# EAGLE design pitchosc (EAGLE 5.04)
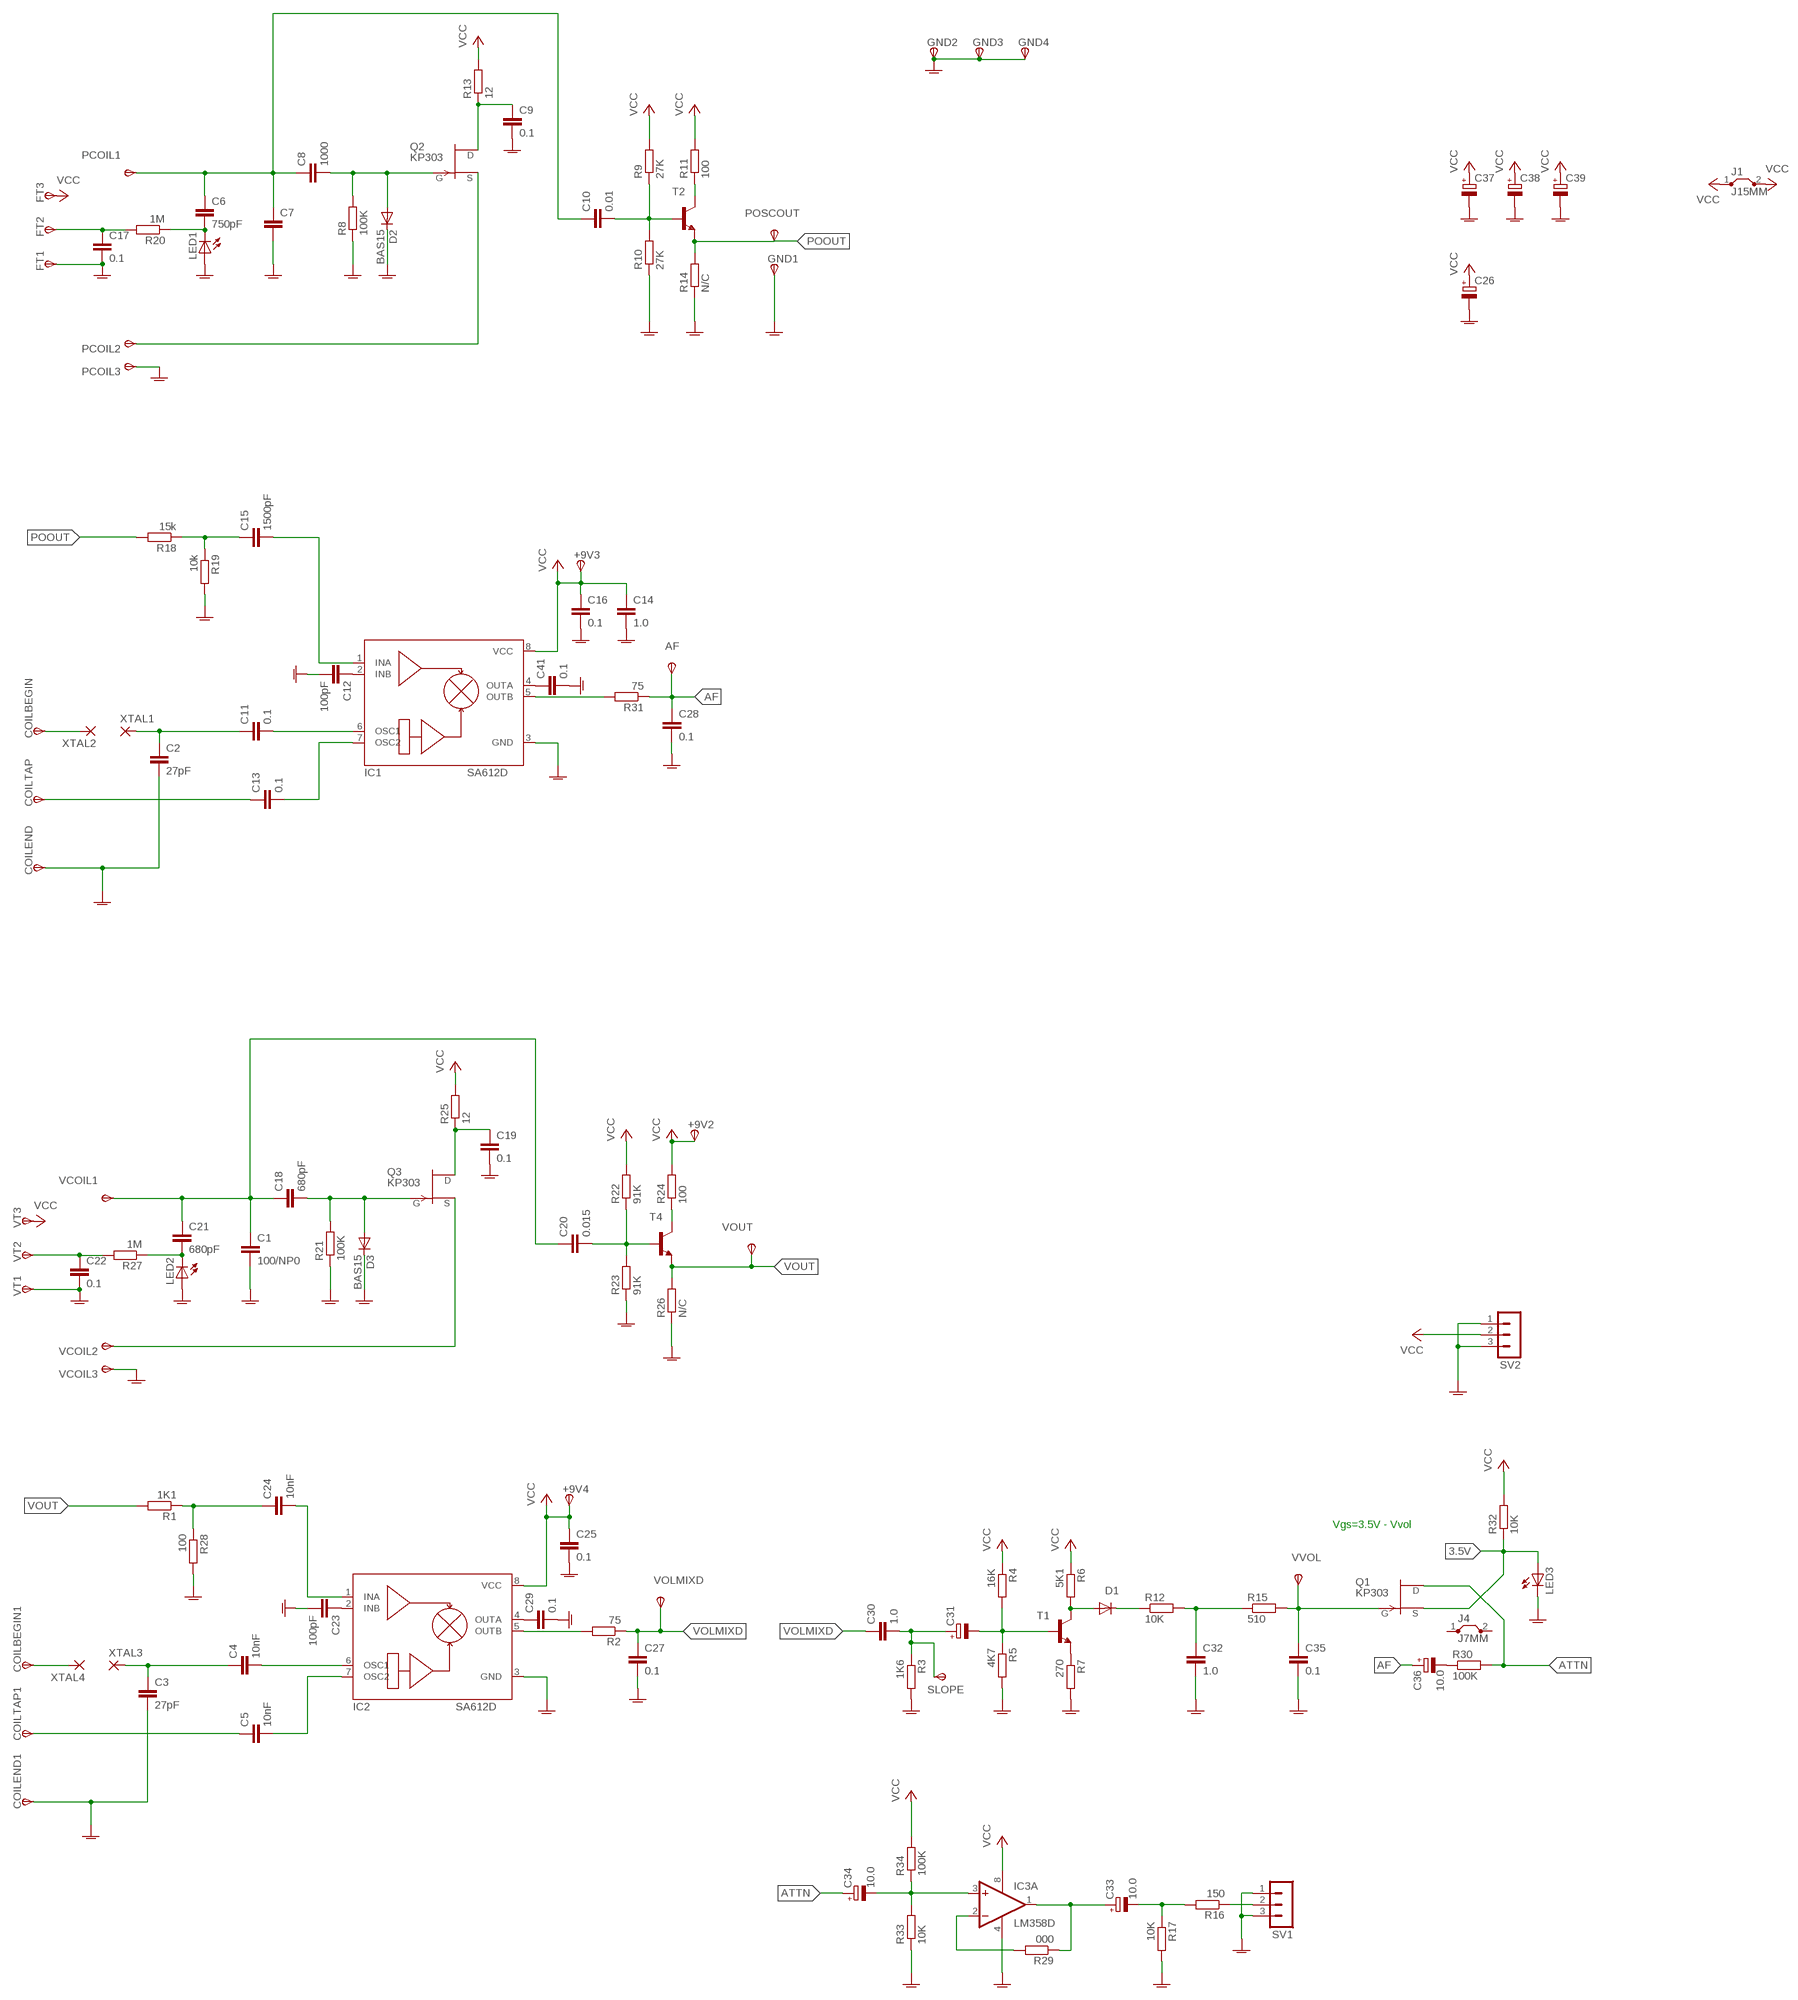
[diagram p0: schematic, sheet 1]

## Parts
+9V2  TPSPAD1-20  [P1-20]
+9V3  TPSPAD1-20  [P1-20]
+9V4  TPSPAD1-20  [P1-20]
AF  TPSPAD1-13Y  [P1-13Y]
C1  100/NP0  C-EUC0805K  [C0805K]
C2  27pF  C-EUC0805K  [C0805K]
C3  27pF  C-EUC0805K  [C0805K]
C4  10nF  C-EUC0805K  [C0805K]
C5  10nF  C-EUC0805K  [C0805K]
C6  750pF  C-EUC0805K  [C0805K]
C7  C-EUC0805K  [C0805K]
C8  1000  C-EUC0805K  [C0805K]
C9  0.1  C-EUC0805K  [C0805K]
C10  0.01  C-EUC0805K  [C0805K]
C11  0.1  C-EUC0805K  [C0805K]
C12  100pF  C-EUC0805K  [C0805K]
C13  0.1  C-EUC0805K  [C0805K]
C14  1.0  C-EUC0805K  [C0805K]
C15  1500pF  C-EUC0805K  [C0805K]
C16  0.1  C-EUC0805K  [C0805K]
C17  0.1  C-EUC0805K  [C0805K]
C18  680pF  C-EUC0805K  [C0805K]
C19  0.1  C-EUC0805K  [C0805K]
C20  0.015  C-EUC0805K  [C0805K]
C21  680pF  C-EUC0805K  [C0805K]
C22  0.1  C-EUC0805K  [C0805K]
C23  100pF  C-EUC0805K  [C0805K]
C24  10nF  C-EUC0805K  [C0805K]
C25  0.1  C-EUC0805K  [C0805K]
C26  CPOL-EUC/6032-28R  [C/6032-28R]
C27  0.1  C-EUC0805K  [C0805K]
C28  0.1  C-EUC0805K  [C0805K]
C29  0.1  C-EUC0805K  [C0805K]
C30  1.0  C-EUC0805K  [C0805K]
C31  CPOL-EUB/3528-21R  [B/3528-21R]
C32  1.0  C-EUC0805K  [C0805K]
C33  10.0  CPOL-EUB/3528-21R  [B/3528-21R]
C34  10.0  CPOL-EUB/3528-21R  [B/3528-21R]
C35  0.1  C-EUC0805K  [C0805K]
C36  10.0  CPOL-EUB/3528-21R  [B/3528-21R]
C37  CPOL-EUB/3528-21R  [B/3528-21R]
C38  CPOL-EUB/3528-21R  [B/3528-21R]
C39  CPOL-EUB/3528-21R  [B/3528-21R]
C41  0.1  C-EUC0805K  [C0805K]
COILBEGIN  TPSPAD1-20Y  [P1-20Y]
COILBEGIN1  TPSPAD1-20Y  [P1-20Y]
COILEND  TPSPAD1-20Y  [P1-20Y]
COILEND1  TPSPAD1-20Y  [P1-20Y]
COILTAP  TPSPAD1-20Y  [P1-20Y]
COILTAP1  TPSPAD1-20Y  [P1-20Y]
D1  BAS15  [DO34-7]
D2  BAS15  [DO34-7]
D3  BAS15  [DO34-7]
FT1  TPSPAD1-13Y  [P1-13Y]
FT2  TPSPAD1-13Y  [P1-13Y]
FT3  TPSPAD1-13Y  [P1-13Y]
GND1  TPSPAD1-20Y  [P1-20Y]
GND2  TPSPAD1-20Y  [P1-20Y]
GND3  TPSPAD1-20Y  [P1-20Y]
GND4  TPSPAD1-20Y  [P1-20Y]
IC1  SA612D  [SO08]
IC2  SA612D  [SO08]
IC3  LM358D  [SO08]
J1  J15MM  [15]
J4  J7MM  [07]
LED1  LED5MM  [LED5MM]
LED2  LED5MM  [LED5MM]
LED3  LED5MM  [LED5MM]
PCOIL1  TPSPAD1-20Y  [P1-20Y]
PCOIL2  TPSPAD1-20Y  [P1-20Y]
PCOIL3  TPSPAD1-20Y  [P1-20Y]
POSCOUT  TPSPAD1-13Y  [P1-13Y]
Q1  KP303  [TO72]
Q2  KP303  [TO72]
Q3  KP303  [TO72]
R1  1K1  R-EU_R0805  [R0805]
R2  75  R-EU_R0805  [R0805]
R3  1K6  R-EU_R0805  [R0805]
R4  16K  R-EU_R0805  [R0805]
R5  4K7  R-EU_R0805  [R0805]
R6  5K1  R-EU_R0805  [R0805]
R7  270  R-EU_R0805  [R0805]
R8  100K  R-EU_R0805  [R0805]
R9  27K  R-EU_R0805  [R0805]
R10  27K  R-EU_R0805  [R0805]
R11  100  R-EU_R0805  [R0805]
R12  10K  R-EU_R0805  [R0805]
R13  12  R-EU_R0805  [R0805]
R14  N/C  R-EU_R0805  [R0805]
R15  510  R-EU_R0805  [R0805]
R16  150  R-EU_R0805  [R0805]
R17  10K  R-EU_R0805  [R0805]
R18  15k  R-EU_R0805  [R0805]
R19  10k  R-EU_R0805  [R0805]
R20  1M  R-EU_R0805  [R0805]
R21  100K  R-EU_R0805  [R0805]
R22  91K  R-EU_R0805  [R0805]
R23  91K  R-EU_R0805  [R0805]
R24  100  R-EU_R0805  [R0805]
R25  12  R-EU_R0805  [R0805]
R26  N/C  R-EU_R0805  [R0805]
R27  1M  R-EU_R0805  [R0805]
R28  100  R-EU_R0805  [R0805]
R29  000  R-EU_R0805  [R0805]
R30  100K  R-EU_R0805  [R0805]
R31  75  R-EU_R0805  [R0805]
R32  10K  R-EU_R0805  [R0805]
R33  10K  R-EU_R0805  [R0805]
R34  100K  R-EU_R0805  [R0805]
SLOPE  TPSPAD1-13Y  [P1-13Y]
SV1  MA03-1  [MA03-1]
SV2  MA03-1  [MA03-1]
T1  BC817-16-NPN-SOT23-BEC  [SOT23-BEC]
T2  BC817-16-NPN-SOT23-BEC  [SOT23-BEC]
T4  BC817-16-NPN-SOT23-BEC  [SOT23-BEC]
VCOIL1  TPSPAD1-20Y  [P1-20Y]
VCOIL2  TPSPAD1-20Y  [P1-20Y]
VCOIL3  TPSPAD1-20Y  [P1-20Y]
VOLMIXD  TPSB2,54  [B2,54]
VOUT  TPSPAD1-13Y  [P1-13Y]
VT1  TPSPAD1-20Y  [P1-20Y]
VT2  TPSPAD1-20Y  [P1-20Y]
VT3  TPSPAD1-20Y  [P1-20Y]
VVOL  TPSB2,54  [B2,54]
XTAL1  2,54/1,1  [2,54/1,1]
XTAL2  2,54/1,1  [2,54/1,1]
XTAL3  2,54/1,1  [2,54/1,1]
XTAL4  2,54/1,1  [2,54/1,1]

## Nets
3.5V: LED3.A Q1.1(S) R32.1
AAA: C34.- IC3.3(A:+IN) R33.2 R34.1
AF: AF.1(PP) C28.1 C36.+ R31.1
AGND: C1.2 C2.2 C3.2 C7.2 C9.2 C12.2 C14.2 C16.2 C17.2 C19.2 C22.2 C23.2 C25.2 C26.- C27.2 C28.2 C29.2 C32.2 C35.2 C37.- C38.- C39.- C41.2 COILEND1.1(PP) COILEND.1(PP) D2.C D3.C FT1.1(PP) GND1.1(PP) GND2.1(PP) GND3.1(PP) GND4.1(PP) IC1.3(GND) IC2.3(GND) IC3.4(P:V-) LED1.A LED2.A LED3.K(C) PCOIL3.1(PP) R3.2 R5.2 R7.2 R8.1 R10.1 R14.1 R17.2 R19.2 R21.1 R23.1 R26.1 R28.2 R33.1 SV1.1 SV1.3 SV2.1 SV2.3 VCOIL3.1(PP) VT1.1(PP)
ATTN: C34.+ Q1.2(D) R30.2
N$1: C4.2 IC2.6(OSC1)
N$2: C5.2 IC2.7(OSC2)
N$3: C6.2 LED1.K(C) R20.1
N$4: C11.2 IC1.6(OSC1)
N$5: IC3.2(A:-IN) R29.2
N$6: C23.1 IC2.2(INB)
N$7: C24.2 IC2.1(INA)
N$8: C6.1 C7.1 C8.1 C10.1 PCOIL1.1(PP)
N$9: COILBEGIN1.1(PP) XTAL4.1(P)
N$10: C8.2 D2.A Q2.3(G) R8.2
N$11: PCOIL2.1(PP) Q2.1(S)
N$12: C10.2 R9.1 R10.2 T2.B
N$13: R11.1 T2.C
N$14: C17.1 FT2.1(PP) R20.2
N$15: C13.2 IC1.7(OSC2)
N$16: C9.1 Q2.2(D) R13.1
N$17: COILBEGIN.1(PP) XTAL2.1(P)
N$18: IC2.5(OUTB) R2.2
N$19: C29.1 IC2.4(OUTA)
N$20: C5.1 COILTAP1.1(PP)
N$21: C15.1 R18.1 R19.1
N$22: C1.1 C18.1 C20.1 C21.1 VCOIL1.1(PP)
N$23: C3.1 C4.1 XTAL3.1(P)
N$24: C12.1 IC1.2(INB)
N$25: C15.2 IC1.1(INA)
N$26: IC1.5(OUTB) R31.2
N$27: C18.2 D3.A Q3.3(G) R21.2
N$28: Q3.1(S) VCOIL2.1(PP)
N$29: C20.2 R22.1 R23.2 T4.B
N$30: R24.1 T4.C
N$31: C19.1 Q3.2(D) R25.1
N$32: C21.2 LED2.K(C) R27.1
N$33: C22.1 R27.2 VT2.1(PP)
N$34: C30.2 C31.+ R3.1 SLOPE.1(PP)
N$35: C31.- R4.2 R5.1 T1.B
N$36: R16.1 SV1.2
N$37: D1.A R6.2 T1.C
N$38: R7.1 T1.E
N$39: C24.1 R1.1 R28.1
N$40: D1.C R12.1
N$43: C36.- R30.1
N$44: C41.1 IC1.4(OUTA)
N$45: C33.+ IC3.1(A:OUT) R29.1
N$46: C13.1 COILTAP.1(PP)
N$47: C2.1 C11.1 XTAL1.1(P)
N$48: C33.- R16.2 R17.1
N$50: C32.1 R12.2 R15.1
POOUT: POSCOUT.1(PP) R14.2 R18.2 T2.E
VCC: +9V2.1(PP) +9V3.1(PP) +9V4.1(PP) C14.1 C16.1 C25.1 C26.+ C37.+ C38.+ C39.+ FT3.1(PP) IC1.8(VCC) IC2.8(VCC) IC3.8(P:V+) J1.1 J1.2 R4.1 R6.1 R9.2 R11.2 R13.2 R22.2 R24.2 R25.2 R32.2 R34.2 SV2.2 VT3.1(PP)
VOLMIXD: C27.1 C30.1 R2.1 VOLMIXD.PP
VOUT: R1.2 R26.2 T4.E VOUT.1(PP)
VVOL: C35.1 Q1.3(G) R15.2 VVOL.PP
Unconnected: IC3.5(B:+IN) IC3.6(B:-IN) IC3.7(B:OUT) J4.1 J4.2

## Notes on the sheet
- Vgs=3.5V - Vvol

## Library data of the parts
+9V2-+9V4 AF COILBEGIN COILBEGIN1 COILEND COILEND1 COILTAP COILTAP1 FT1-FT3 GND1-GND4 PCOIL1-PCOIL3 POSCOUT SLOPE VCOIL1-VCOIL3 VOLMIXD VOUT VT1-VT3 VVOL = 0-svo:TPS: TEST PIN
C1-C25 C27-C30 C32 C35 C41 = rcl:C-EU: CAPACITOR, European symbol
C26 C31 C33 C34 C36-C39 = rcl:CPOL-EU: POLARIZED CAPACITOR, European symbol
D1-D3 = diode:BAS15: DIODE high speed
IC1 IC2 = 0-svo:SA612*
IC3 = linear:LM358: OP AMP also LM158; LM258; LM2904 Source: http://cache.national.com/ds/LM/LM158.pdf
J1 J4 = jumper:J: Bridge
LED1-LED3 = led:LED: LED OSRAM: - CHIPLED LG R971, LG N971, LY N971, LG Q971, LY Q971, LO R971, LY R971 LH N974, LH R974 LS Q976, LO Q976, LY Q976 LO Q996 - Hyper CHIPLED LW Q18S LB Q993, LB Q99A, LB R99A - SideLED LS A670, LO A670, LY A670, LG A670, LP A670 LB A673, LV A673, LT A673, LW A673 LH A674 LY A675 LS A676, LA A676, LO A676, LY A676, LW A676 LS A679, LY A679, LG A679 - Hyper Micro SIDELED® LS Y876, LA Y876, LO Y876, LY Y876 LT Y87S - SmartLED LW L88C, LW L88S LB L89C, LB L89S, LG L890 LS L89K, LO L89K, LY L89K LS L896, LA L896, LO L896, LY L896 - TOPLED LS T670, LO T670, LY T670, LG T670, LP T670 LSG T670, LSP T670, LSY T670, LOP T670, LYG T670 LG T671, LOG T671, LSG T671 LB T673, LV T673, LT T673, LW T673 LH T674 LS T676, LA T676, LO T676, LY T676, LB T676, LH T676, LSB T676, LW T676 LB T67C, LV T67C, LT T67C, LS T67K, LO T67K, LY T67K, LW E67C LS E67B, LA E67B, LO E67B, LY E67B, LB E67C, LV E67C, LT E67C LW T67C LS T679, LY T679, LG T679 LS T770, LO T770, LY T770, LG T770, LP T770 LB T773, LV T773, LT T773, LW T773 LH T774 LS E675, LA E675, LY E675, LS T675 LS T776, LA T776, LO T776, LY T776, LB T776 LHGB T686 LT T68C, LB T68C - Hyper Mini TOPLED® LB M676 - Mini TOPLED Santana® LG M470 LS M47K, LO M47K, LY M47K Source: http://www.osram.convergy.de - LUMILED® LXK2-PW12-R00, LXK2-PW12-S00, LXK2-PW14-U00, LXK2-PW14-V00 LXK2-PM12-R00, LXK2-PM12-S00, LXK2-PM14-U00 LXK2-PE12-Q00, LXK2-PE12-R00, LXK2-PE12-S00, LXK2-PE14-T00, LXK2-PE14-U00 LXK2-PB12-K00, LXK2-PB12-L00, LXK2-PB12-M00, LXK2-PB14-N00, LXK2-PB14-P00, LXK2-PB14-Q00 LXK2-PR12-L00, LXK2-PR12-M00, LXK2-PR14-Q00, LXK2-PR14-R00 LXK2-PD12-Q00, LXK2-PD12-R00, LXK2-PD12-S00 LXK2-PH12-R00, LXK2-PH12-S00 LXK2-PL12-P00, LXK2-PL12-Q00, LXK2-PL12-R00 Source: www.luxeon.com
Q1-Q3 = 0-svo:KP303*: N-Channel Junction FET
R1-R34 = rcl:R-EU_: RESISTOR, European symbol
SV1 SV2 = con-lstb:MA03-1: PIN HEADER
T1 T2 T4 = transistor:*-NPN-: NPN Transistror BF959 corrected 2008.03.06
XTAL1-XTAL4 = wirepad:2,54/1,1: THROUGH-HOLE PAD

## Board
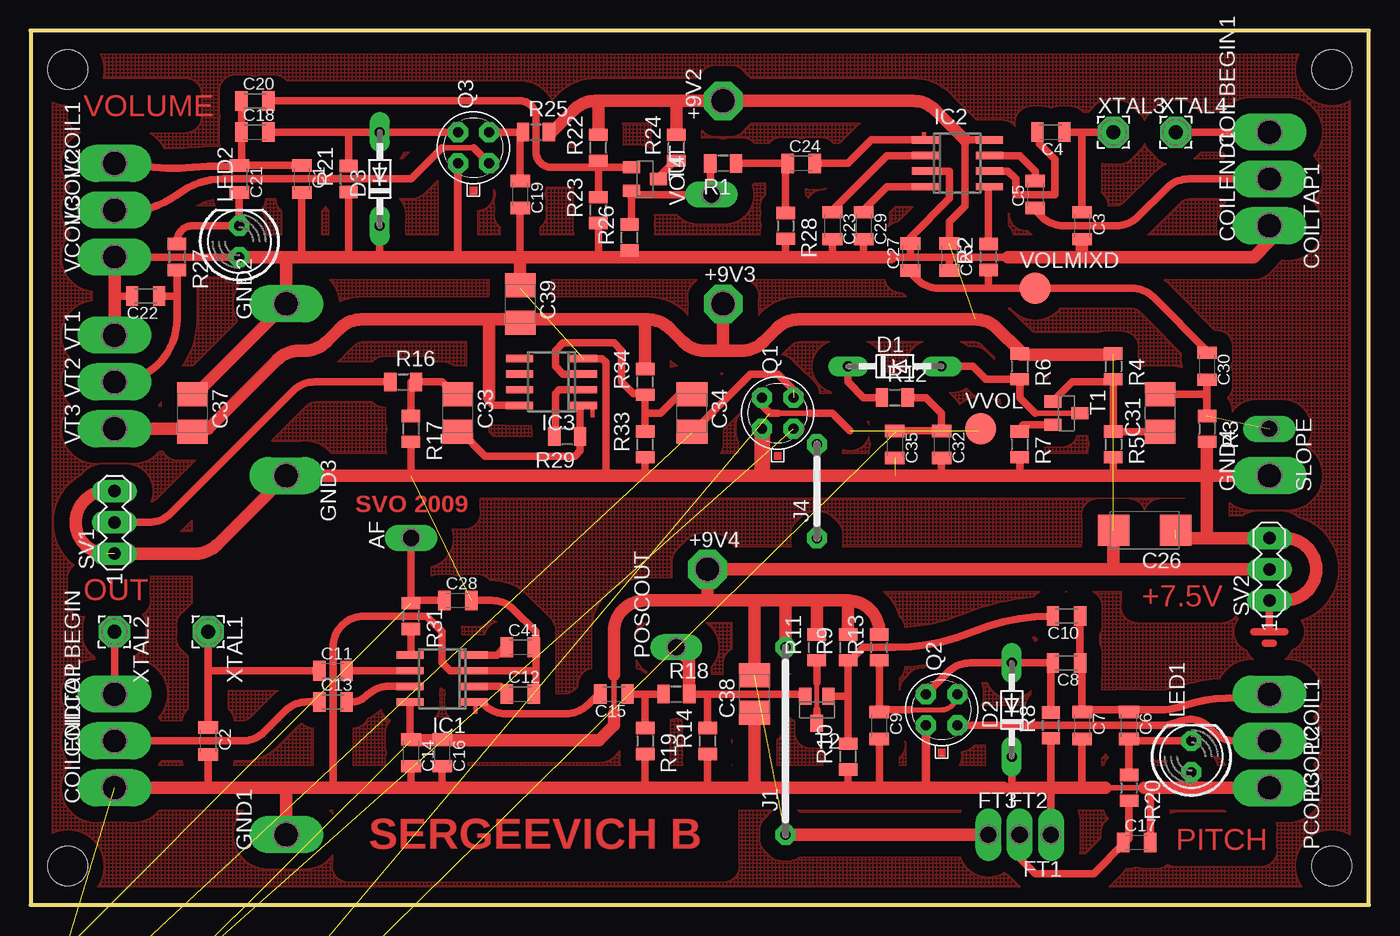
[diagram p1: board, top side]

Size 108.89 x 71.11 mm. Coordinates in mm from the lower left corner, seen from the top.
Outline: 0,0 108.89,0 108.89,71.11 0,71.11 0,0
Copper layers (1*16): Top 0.035mm / dielectric 1.5mm / Bottom 0.035mm
Design rules "default *": minimum track width 10mil, minimum drill 24mil, track to track 8mil, track to pad 8mil, pad to pad 8mil, via to via 8mil, smd to smd 8mil, copper to edge 40mil, drill to drill 8mil, minimum pad ring 16mil, minimum via ring 8mil, stop-mask expansion 4mil, vias tented up to drill 0mil, thermal gap 10mil
Holes 3.2 mm at 3.01,67.94 3.01,3.17 105.88,3.17 105.88,67.94
tRestrict: area 14.4,19.7 to 28.4,33.7; area 25.9,3.2 to 56.4,8.2

### Footprints (pad centres in the part's own frame; a part is rotated, then mirrored left to right if it is on the bottom)
P1-20 = drill 2.007 pad 3.15 octagon: 1 0,0
P1-13Y = drill 1.321 pad 1.905 long: 1 0,0
C0805K = smd 1 x 1.6: 1 -1.1,0; 2 1.1,0
C/6032-28R = smd 2.55 x 2.5: + 2.525,0; - -2.525,0
B/3528-21R = smd 1.95 x 2.5: + 1.525,0; - -1.525,0
P1-20Y = drill 2.007 pad 2.54 long: 1 0,0
DO34-7 = drill 0.813 long: A 3.81,0; C -3.81,0
SO08 = smd 0.6 x 2.2: 1 -1.905,-2.6; 2 -0.635,-2.6; 3 0.635,-2.6; 4 1.905,-2.6; 5 1.905,2.6; 6 0.635,2.6; 7 -0.635,2.6; 8 -1.905,2.6
15 = drill 0.813 pad 1.6 octagon: 1 -7.62,0; 2 7.62,0
07 = drill 0.813 pad 1.6 octagon: 1 -3.81,0; 2 3.81,0
LED5MM = drill 0.813 octagon: A -1.27,0; K 1.27,0
TO72 = drill 0.813 octagon: 1 -1.27,-1.27; 2 1.27,-1.27; 3 1.27,1.27; 4 -1.27,1.27
R0805 = smd 1 x 1.5: 1 -1.05,0; 2 1.05,0
MA03-1 = drill 1.016 long: 1 -2.54,0; 2 0,0; 3 2.54,0
SOT23-BEC = smd 1 x 1.4: B -0.95,-1.1; C 0,1.1; E 0.95,-1.1
B2,54 = smd 2.54 x 2.54: PP 0,0
2,54/1,1 = drill 1.118 pad 2.54 octagon: 1 0,0

### Placement (x,y rotation side)
+9V2  56.35,65.4 90 top
+9V3  56.35,48.89 0 top
+9V4  55.08,27.3 0 top
AF  30.95,29.84 90 top
C1  22.06,59.05 270 top
C2  14.44,13.33 270 top
C3  85.56,55.24 270 top
C4  83.02,62.86 180 top
C5  81.75,57.78 90 top
C6  89.37,14.6 270 top
C7  85.56,14.6 270 top
C8  84.29,19.68 180 top
C9  69.05,14.6 270 top
C10  84.29,23.49 180 top
C11  24.6,19.04 0 top
C12  39.84,17.14 0 top
C13  24.6,16.5 0 top
C14  30.95,12.38 270 top
C15  47.46,17.14 180 top
C16  33.49,12.38 270 top
C17  90.01,5.08 0 top
C18  18.25,62.86 0 top
C19  39.84,57.78 270 top
C20  18.25,65.4 0 top
C21  16.98,59.05 270 top
C22  9.36,49.53 180 top
C23  65.24,55.24 270 top
C24  62.7,60.32 0 top
C25  74.77,52.7 270 top
C26  90.64,30.47 180 top
C27  71.59,52.7 90 top
C28  34.76,24.76 0 top
C29  67.78,55.24 270 top
C30  95.72,43.81 270 top
C31  91.91,40 90 top
C32  74.13,37.46 270 top
C33  34.76,40 270 top
C34  53.81,40 270 top
C35  70.32,37.46 270 top
C36  -8.42,-13.34 0 top  (outside the outline)
C37  13.17,40 270 top
C38  58.89,17.14 90 top
C39  39.84,48.89 270 top
C41  39.84,20.95 0 top
COILBEGIN  6.82,17.14 90 top
COILBEGIN1  100.8,62.86 90 top
COILEND  6.82,9.52 90 top
COILEND1  100.8,55.24 90 top
COILTAP  6.82,13.33 90 top
COILTAP1  100.8,59.05 270 top
D1  70.32,43.81 0 top
D2  79.84,15.87 90 top
D3  28.41,59.05 90 top
FT1  83.02,5.71 180 top
FT2  80.48,5.71 0 top
FT3  77.94,5.71 0 top
GND1  20.79,5.71 90 top
GND2  20.79,48.89 90 top
GND3  20.79,34.92 270 top
GND4  100.8,34.92 90 top
IC1  33.49,18.41 90 top
IC2  75.4,60.32 270 top
IC3  42.38,42.54 90 top
J1  61.43,13.33 90 top
J4  63.97,33.65 90 top
LED1  94.45,12.06 90 top
LED2  16.98,53.97 90 top
LED3  -7.15,-32.39 0 top  (outside the outline)
PCOIL1  100.8,17.14 270 top
PCOIL2  100.8,13.33 270 top
PCOIL3  100.8,9.52 270 top
POSCOUT  52.54,20.95 90 top
Q1  60.79,40 90 top
Q2  74.13,15.87 90 top
Q3  36.03,61.59 90 top
R1  56.35,60.32 180 top
R2  77.94,52.7 90 top
R3  95.72,38.73 270 top
R4  88.1,43.81 270 top
R5  88.1,37.46 270 top
R6  80.48,43.81 270 top
R7  80.48,37.46 270 top
R8  83.02,14.6 90 top
R9  66.51,20.95 90 top
R10  66.51,12.06 90 top
R11  63.97,20.95 90 top
R12  70.32,41.27 0 top
R13  69.05,20.95 90 top
R14  55.08,13.33 90 top
R15  -8.42,-40.01 0 top  (outside the outline)
R16  30.31,42.54 0 top
R17  30.95,38.73 270 top
R18  52.54,17.14 0 top
R19  50,13.33 270 top
R20  89.37,9.52 270 top
R21  25.87,59.05 90 top
R22  46.19,61.59 90 top
R23  46.19,56.51 90 top
R24  52.54,61.59 90 top
R25  41.11,62.86 0 top
R26  48.73,54.29 90 top
R27  11.9,52.7 270 top
R28  61.43,55.24 270 top
R29  43.65,38.1 180 top
R30  -8.42,-18.42 0 top  (outside the outline)
R31  30.95,23.49 270 top
R32  -8.42,-24.77 0 top  (outside the outline)
R33  50,37.46 90 top
R34  50,42.54 90 top
SLOPE  100.8,38.73 270 top
SV1  6.82,31.11 90 top
SV2  100.8,27.3 90 top
T1  84.29,40 270 top
T2  63.97,15.87 180 top
T4  50,59.05 270 top
VCOIL1  6.82,60.32 90 top
VCOIL2  6.82,56.51 90 top
VCOIL3  6.82,52.7 90 top
VOLMIXD  81.75,50.16 0 top
VOUT  55.4,57.78 90 top
VT1  6.82,46.35 90 top
VT2  6.82,42.54 90 top
VT3  6.82,38.73 90 top
VVOL  77.31,38.73 0 top
XTAL1  14.44,22.22 270 top
XTAL2  6.82,22.22 270 top
XTAL3  88.1,62.86 0 top
XTAL4  93.18,62.86 0 top

### Tracks (layer width: path | path; a pad name or v marks a point on that pad's centre or on a via)
3.5V  (2 unrouted)
  Top 0.61: Q1.1 62.7,38.73
AAA
  Top 0.61: C34.- 52.79,41.53 51.27,40 50,40 | 50,40 R34.1 50,41.59 49.05,41.59 48.09,42.54 48.09,45.08 47.46,45.72 43.33,45.72 42.7,45.08 42.7,43.81 43.33,43.18 IC3.3 | 50,40 R33.2
AF  (1 unrouted)
  Top 0.61: R31.1 30.95,24.76 | 30.95,24.76 C28.1 | 30.95,24.76 AF.1
AGND  (6 unrouted)
  Top 0.459: 87.47,9.52 90.64,9.52
  Top 0.61: 79.21,9.52 79.84,9.52 D2.C | 85.56,9.52 C7.2 | R8.1 83.02,9.52 FT1.1 | 66.51,9.52 R10.1 | 69.05,9.52 C9.2 | 95.72,9.52 95.55,9.35 | 7.14,52.7 LED2.A | 22.06,52.7 C1.2 | 28.41,52.7 D3.C | 25.87,52.7 R21.1 | 46.19,52.7 R23.1 | 7.14,52.7 VCOIL3.1 | 6.82,52.38 7.14,52.7 | 6.82,49.53 C22.2 | 48.73,52.7 R26.1 | 39.84,52.7 C19.2 | C39.- 39.84,50.16 | 55.08,9.52 R14.1 | 50,9.52 R19.2 | 41.11,19.04 IC1.3 34.12,19.04 33.49,19.68 33.49,22.22 32.22,23.49 27.14,23.49 arc90 24.6,20.95 24.6,9.52 | 41.11,19.04 41.11,20.63 40.94,20.8 C41.2 41.11,20.95 41.11,22.22 39.31,24.02 arc45 37.52,24.76 C28.2 | C12.2 41.11,17.14 41.11,19.04 | 30.95,9.52 C14.2 | 33.49,9.52 C16.2 | 14.44,9.52 C2.2 | 61.43,52.7 R28.2 | 67.78,52.7 C29.2 | 65.24,52.7 C23.2 | 88.1,34.92 R5.2 | 80.48,34.92 R7.2 | 74.13,34.92 C32.2 | 70,52.7 71.59,52.7 | 71.59,52.7 74.77,52.7 | 74.77,52.7 79.53,52.7 | 71.59,52.7 C27.2 71.59,54.29 74.77,57.46 74.77,59.69 IC2.3 | 74.77,52.7 C25.2 | 50,34.92 R33.1 | 30.95,34.92 R17.2 | IC3.4 46.51,44.45 46.82,44.13 46.82,34.92 | C17.2 91.11,9.37 90.96,9.52 | SV2.1 100.8,22.22
  Top 1.016: 79.21,9.52 69.05,9.52 66.51,9.52 58.89,9.52 | 79.84,9.52 83.02,9.52 85.56,9.52 87.47,9.52 | PCOIL3.1 95.72,9.52 94.45,9.52 | LED2.A 20.79,52.7 | 20.79,52.7 22.06,52.7 25.87,52.7 28.41,52.7 39.84,52.7 | 39.84,52.7 46.19,52.7 48.73,52.7 61.43,52.7 65.24,52.7 67.78,52.7 70,52.7 | VT1.1 6.82,49.53 6.82,52.38 | 85.56,52.7 99.53,52.7 100.8,53.97 COILEND1.1 | 39.84,52.7 C39.- | COILEND.1 14.44,9.52 20.79,9.52 | 20.79,9.52 24.6,9.52 30.95,9.52 33.49,9.52 50,9.52 55.08,9.52 58.89,9.52 | 58.89,9.52 C38.- | 85.56,52.7 C3.2 | 95.72,34.92 R3.2 | 95.72,34.92 88.1,34.92 80.48,34.92 74.13,34.92 70.32,34.92 66.51,34.92 50,34.92 46.82,34.92 30.95,34.92 GND3.1 15.18,29.31 arc-45 13.39,28.57 6.18,28.57 arc-90 3.64,31.11 arc-90 6.18,33.65 SV1.3 | 79.53,52.7 85.56,52.7 | 20.79,9.52 GND1.1 | 20.79,52.7 GND2.1 13.42,41.53 C37.- | SV2.1 102.07,24.76 arc90 104.61,27.3 arc90 102.07,29.84 SV2.3 95.72,29.84 | 95.72,34.92 95.72,29.84 | 95.72,29.84 93.18,29.84 | 90.64,9.52 90.96,9.52 94.45,9.52 | 94.45,9.52 LED1.A | 95.72,34.92 GND4.1
ATTN  (2 unrouted)
  Top 0.61: 53.81,38.73 C34.+ 53.81,38.41 58.57,43.18 60.79,43.18 62.06,41.91
GND
  pour Top (isolate 1.27, hatched): 1.74,69.21 1.74,-0.64 108.42,-0.64 108.42,69.21
N$1
  Top 0.61: C4.2 81.75,62.86 82.07,62.54 82.07,61.91 83.34,60.64 83.34,57.78 80.16,57.78 80.16,59.05 79.53,59.69 IC2.6 77.94,59.69
N$2
  Top 0.61: C5.2 81.75,59.69 80.48,60.96 IC2.7
N$3
  Top 0.61: R20.1 89.37,13.33 | 89.37,13.33 C6.2 | 89.37,13.33 LED1.K
N$4
  Top 0.61: 25.55,19.04 C11.2 IC1.6
N$5
  Top 0.61: IC3.2 43.02,41.91 42.7,41.59 42.7,38.1 R29.2
N$6
  Top 0.61: C23.1 65.24,56.51 69.69,60.96 IC2.2
N$7
  Top 0.61: IC2.1 68.42,62.23 66.51,60.32 C24.2
N$8
  Top 0.61: 85.56,19.68 C7.1 85.73,15.87 89.37,15.87 | 85.56,19.68 C8.1 | C10.1 85.39,19.85 85.56,19.68 | 89.37,15.87 C6.1 | 89.37,15.87 91.91,15.87 arc19 93.82,16.19 arc-17 97.31,16.82 arc-3 102.39,16.82 PCOIL1.1
N$9
  Top 0.61: XTAL4.1 COILBEGIN1.1
N$10
  Top 0.61: R8.2 83.02,19.68 C8.2 D2.A 76.45,19.68 arc45 74.66,18.94 Q2.3
N$11
  Top 0.61: Q2.1 91.91,14.6 arc23 93.5,14.92 arc-73 96.04,14.28 arc48 97.94,13.33 arc5 102.39,13.33 PCOIL2.1
N$12
  Top 0.61: R10.2 66.51,17.14 | 66.51,17.14 66.51,19.68 | 66.51,19.68 R9.1 | 66.51,19.68 67.78,20.95 70.32,20.95 arc23 76.67,22.22 arc-23 83.02,23.49 C10.2 | T2.B 66.34,16.97 66.51,17.14
N$13
  Top 0.408: 63.97,15.87 63.97,18.09
  Top 0.61: 63.97,18.09 R11.1 | 63.97,14.6 T2.C 63.97,15.87
N$14
  Top 0.61: 89.37,8.25 R20.2 | 89.37,8.25 89.54,8.42 | FT2.1 80.48,3.8 81.75,2.54 86.51,2.54 89.05,5.08 | 89.05,5.08 C17.1 | 89.37,8.25 89.37,5.39 89.05,5.08
N$15
  Top 0.61: IC1.7 29.15,17.77 arc45 27.35,17.03 arc-45 26.08,16.5 C13.2
N$16
  Top 0.406: 71.59,15.87 74.13,15.87 arc90 Q2.2
  Top 0.61: 69.05,15.87 R13.1 68.83,19.9 68.73,20 | C9.1 69.05,15.87 | 69.05,15.87 71.59,15.87
N$17
  Top 0.61: COILBEGIN.1 XTAL2.1
N$18
  Top 0.61: IC2.5 77.94,58.41 R2.2
N$19
  Top 0.61: C29.1 67.78,56.51 69.69,58.41 IC2.4
N$20
  Top 0.61: COILTAP1.1 94.23,59.05 arc45 92.44,58.31 90.11,55.98 arc-45 88.32,55.24 84.07,55.24 arc-45 82.28,55.98 81.75,56.51 C5.1
N$21
  Top 0.61: R19.1 50,17.14 | 50,17.14 R18.1 | 50,17.14 C15.1
N$22
  Top 0.61: C1.1 17.15,60.15 16.98,60.32 | 16.98,60.32 C21.1 16.98,60 arc11 13.17,60 arc-11 10,60 VCOIL1.1 | 16.98,60.32 17.15,60.49 C18.1 16.98,62.86 17.15,63.03 C20.1
N$23
  Top 0.61: 85.56,62.86 XTAL3.1 | C3.1 85.56,62.86 | 85.56,62.86 C4.1
N$24
  Top 0.61: C12.1 38.89,17.14 38.25,17.77 IC1.2
N$25
  Top 0.61: IC1.1 36.66,16.5 36.87,16.3 arc45 38.67,15.55 43.55,15.55 arc45 45.35,16.3 46.19,17.14 C15.2
N$26
  Top 0.61: IC1.5 30.95,20.31 R31.2
N$27
  Top 0.61: C18.2 25.87,62.86 | 25.87,62.86 D3.A Q3.3 | 25.87,62.86 R21.2
N$28
  Top 0.459: 33.49,61.59 36.03,61.59
  Top 0.61: VCOIL2.1 arc46 11.9,57.78 arc-37 15.71,59.05 30.95,59.05 33.49,61.59 | 36.03,61.59 Q3.1
N$29
  Top 0.61: R22.1 46.29,60.54 46.51,60.32 46.19,60 | 46.19,58.41 46.19,58.1 | 46.19,60 46.19,58.41 | 46.19,58.41 R23.2 | T4.B 46.19,60 | C20.2 39.84,65.4 arc-90 41.11,64.13 41.11,61.27 arc90 42.38,60 46.19,60
N$30
  Top 0.61: R24.1 52.54,60.64 51.1,59.2 T4.C
N$31
  Top 0.61: 39.84,62.86 Q3.2 | 39.84,62.86 R25.1 | C19.1 39.84,62.86
N$32
  Top 0.61: R27.1 11.9,53.97 arc-90 13.17,55.24 LED2.K C21.2
N$33
  Top 0.61: 11.9,49.53 R27.2 | 11.9,49.53 C22.1 | 11.9,49.53 11.9,47.62 arc-90 VT2.1
N$34  (1 unrouted)
  Top 0.61: 95.72,41.27 R3.1 | C31.+ 95.47,41.53 95.72,41.27 | 95.72,41.27 C30.2
N$35
  Top 0.61: C31.- 88.36,38.48 88.1,38.73 R5.1 88.1,42.54 | 88.1,42.54 R4.2 | T1.B 84.78,42.54 88.1,42.54
N$36
  Top 0.61: SV1.2 9.58,31.11 arc45 11.37,31.85 21.32,41.8 arc-45 23.11,42.54 R16.1
N$37
  Top 0.459: 81.75,40 T1.C
  Top 0.61: 81.75,40 80.48,41.27 R6.2 77.72,42.76 76.67,43.81 D1.A
N$38
  Top 0.61: R7.1 80.48,38.73 80.8,39.05 T1.E
N$39
  Top 0.61: 61.43,60.32 C24.1 | 61.43,60.32 R28.1 | R1.1 61.43,60.32
N$40
  Top 0.61: D1.C 66.51,42.54 67.78,41.27 R12.1
N$41
  Top 0.61: 99.53,22.22 102.07,22.22
N$42
  Top 0.61: 100.48,21.27 101.12,21.27
N$43  (1 unrouted)
N$44
  Top 0.61: C41.1 38.57,20.95 37.93,20.31 IC1.4
N$45
  Top 0.61: C33.+ 35.02,38.48 36.98,36.51 44.28,36.51 44.7,36.92 R29.1 44.7,40.41 44.92,40.64 IC3.1
N$46
  Top 0.61: COILTAP.1 17.2,13.33 arc45 18.99,14.07 20.68,15.76 arc-45 22.48,16.5 C13.1
N$47
  Top 0.61: 14.44,19.04 C11.1 | 14.44,19.04 XTAL1.1 | C2.1 14.44,19.04
N$48
  Top 0.61: C33.- 34.51,41.53 33.49,42.54 R16.2 30.95,42.54 R17.1
N$50  (1 unrouted)
  Top 0.61: R12.2 72.86,41.27 74.13,40 C32.1 70.49,38.56 70.32,38.73
POOUT
  Top 0.61: T2.E 62.87,16.97 62.7,17.14 55.08,17.14 | R18.2 55.08,17.14 | 55.08,17.14 R14.2
  Top 1.016: R18.2 53.59,19.9 POSCOUT.1
VCC  (4 unrouted)
  Top 0.459: 47.46,15.55 47.46,18.73
  Top 0.61: 52.54,62.86 R24.2 52.44,62.64 52.22,62.86 | IC1.8 30.89,13.39 30.95,13.33 C14.1 33.34,13.48 33.49,13.33 C16.1 | 88.1,44.76 R4.1 | R6.1 80.58,44.76 | C25.1 74.77,55.56 76.04,56.83 76.04,62.23 IC2.8 | 37.3,41.27 37.3,40.95 37.62,40.64 IC3.8 | 46.19,62.86 R22.2 46.29,62.64 46.51,62.86 46.19,62.86
  Top 1.016: 30.89,13.39 46.25,13.39 47.46,14.6 47.46,15.55 | 55.08,24.76 58.89,24.76 | 47.46,18.73 47.46,22.22 arc-90 50,24.76 55.08,24.76 | 58.89,24.76 61.43,24.76 | 61.43,24.76 63.97,24.76 | 63.97,24.76 66.51,24.76 | 66.51,24.76 arc-90 69.05,22.22 R13.2 | 63.97,24.76 R11.2 | 66.51,24.76 R9.2 | 61.43,24.76 J1.2 | J1.1 FT3.1 | 58.89,24.76 C38.+ | 80.58,44.76 88.1,44.76 | 39.59,47.37 C39.+ 39.84,47.62 | 39.84,47.62 50,47.62 | 50,47.62 R34.2 | 37.3,47.62 37.3,41.27 | 37.3,47.62 39.84,47.62 | R6.1 80.48,45.08 78.68,46.88 arc45 76.89,47.62 62.48,47.62 arc45 60.69,46.88 59.63,45.82 arc-45 57.84,45.08 56.35,45.08 | 50,47.62 50.22,47.62 arc-45 52.01,46.88 53.07,45.82 arc45 54.86,45.08 56.35,45.08 | 56.35,45.08 +9V3.1 | 55.08,24.76 +9V4.1 88.1,27.3 | 13.17,38.73 C37.+ | VT3.1 13.17,38.73 | 13.17,38.73 14.44,38.73 20.05,44.34 arc-45 21.84,45.08 22.28,45.08 arc45 24.07,45.82 25.13,46.88 arc-45 26.92,47.62 37.3,47.62 | 88.1,27.3 SV2.2 | C26.+ 88.12,27.31 88.1,27.3 | R25.2 42.38,62.86 44.18,64.66 arc-45 45.97,65.4 46.19,65.4 | 46.19,65.4 52.54,65.4 | 52.54,65.4 +9V2.1 71.81,65.4 arc-45 73.6,64.66 76.04,62.23 | 46.19,65.4 46.19,62.86 | 52.54,65.4 52.54,62.86
VOLMIXD
  Top 0.61: C27.1 71.59,51.43 72.12,50.9 arc45 73.91,50.16 77.94,50.16 | 77.94,50.16 R2.1 | 77.94,50.16 VOLMIXD.PP 89.59,50.16 arc-45 91.38,49.42 95.72,45.08 C30.1
VOUT
  Top 0.61: R26.2 48.73,55.24 48.9,55.41 T4.E 48.9,57.95 48.73,57.78 55.08,57.78 | 55.4,58.1 VOUT.1 55.08,57.78 | R1.2 55.3,58 55.08,57.78
VVOL  (3 unrouted)
  Top 0.459: 60.79,40 63.34,40
  Top 0.61: 66.68,38.56 66.51,38.73 65.24,40 63.34,40 | 77.31,39.37 VVOL.PP 77.14,38.56 | Q1.3 59.52,40.64 60.16,40 60.79,40
(copper drawn outside any net)
  shapes: Top area x9

### Text on the board
Top: VOLUME | SVO 2009 | +7.5V | OUT | SERGEEVICH B | PITCH